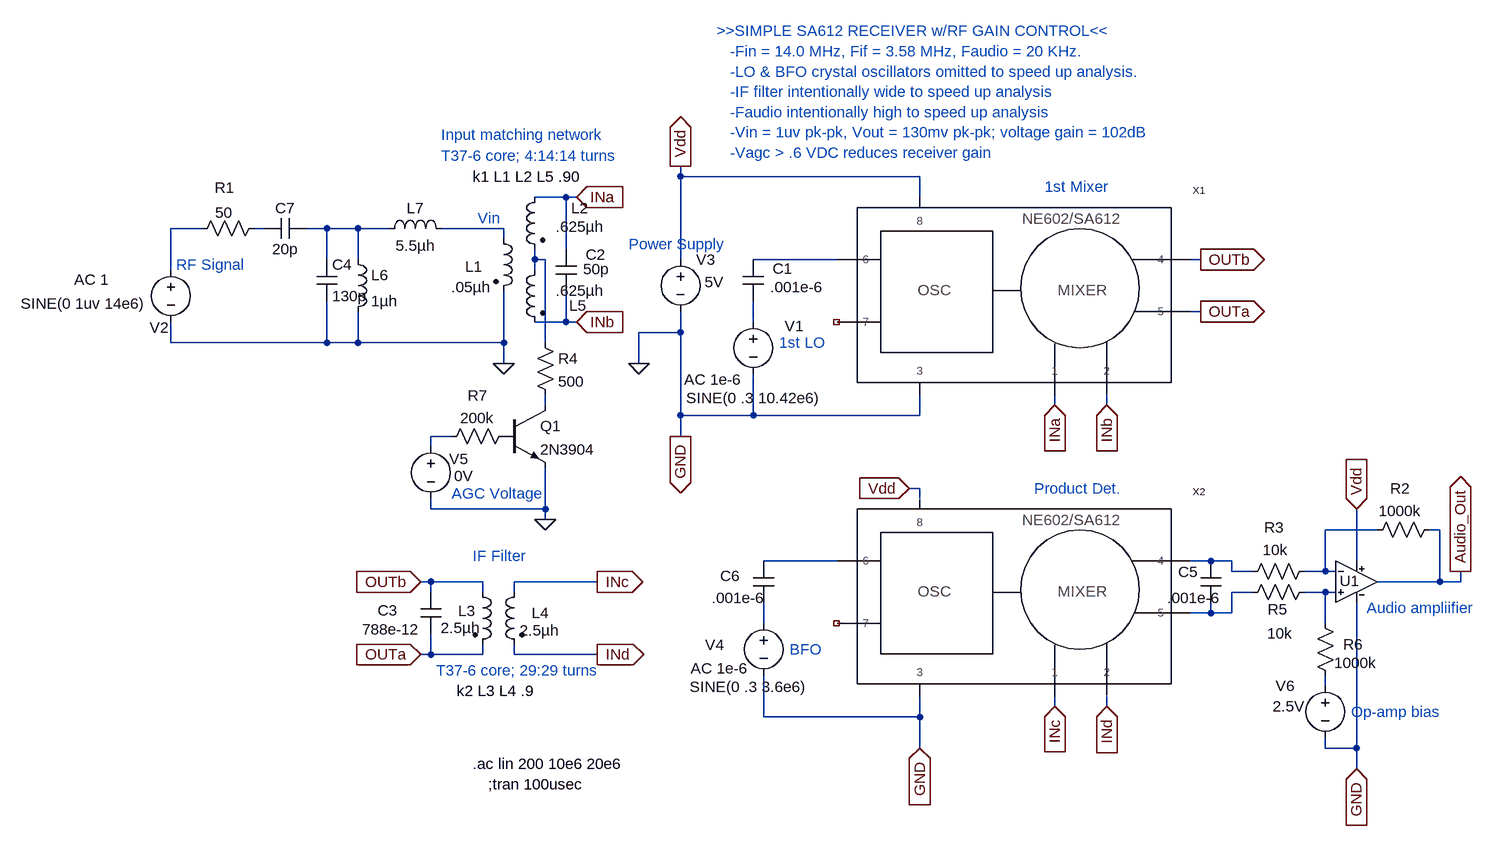
[diagram p0: schematic NE602 Rx.asc]
NE602 Rx.asc, the LTspice schematic file:
Version 4
SHEET 1 2600 1360
WIRE -176 -352 -176 -368
WIRE 192 -352 -176 -352
WIRE -352 -320 -400 -320
WIRE -336 -320 -352 -320
WIRE 192 -320 192 -352
WIRE -912 -272 -960 -272
WIRE -816 -272 -832 -272
WIRE -720 -272 -752 -272
WIRE -672 -272 -720 -272
WIRE -624 -272 -672 -272
WIRE -448 -272 -544 -272
WIRE -448 -256 -448 -272
WIRE -352 -240 -352 -320
WIRE -720 -224 -720 -272
WIRE -672 -224 -672 -272
WIRE -400 -224 -400 -240
WIRE -384 -224 -400 -224
WIRE -176 -224 -176 -352
WIRE 64 -224 -64 -224
WIRE 624 -224 608 -224
WIRE -960 -208 -960 -272
WIRE -400 -208 -400 -224
WIRE 624 -144 608 -144
WIRE -352 -128 -352 -176
WIRE -352 -128 -400 -128
WIRE -336 -128 -352 -128
WIRE -64 -128 -64 -160
WIRE -176 -112 -176 -144
WIRE -176 -112 -240 -112
WIRE -960 -96 -960 -128
WIRE -720 -96 -720 -160
WIRE -720 -96 -960 -96
WIRE -672 -96 -672 -144
WIRE -672 -96 -720 -96
WIRE -448 -96 -448 -176
WIRE -448 -96 -672 -96
WIRE -384 -96 -384 -224
WIRE -448 -64 -448 -96
WIRE -240 -64 -240 -112
WIRE -384 0 -384 -16
WIRE 400 0 400 -16
WIRE 480 0 480 -16
WIRE -176 16 -176 -112
WIRE -64 16 -64 -48
WIRE -64 16 -176 16
WIRE 192 16 192 -16
WIRE 192 16 -64 16
WIRE -528 48 -560 48
WIRE -176 48 -176 16
WIRE -560 64 -560 48
WIRE 192 128 176 128
WIRE 192 144 192 128
WIRE -560 160 -560 144
WIRE -384 160 -384 96
WIRE -384 160 -560 160
WIRE -384 176 -384 160
WIRE 896 192 816 192
WIRE 992 192 976 192
WIRE 64 240 -48 240
WIRE 640 240 608 240
WIRE 672 240 640 240
WIRE 864 240 864 160
WIRE 672 256 672 240
WIRE 704 256 672 256
WIRE 816 256 816 192
WIRE 816 256 784 256
WIRE 832 256 816 256
WIRE -560 272 -576 272
WIRE -480 272 -560 272
WIRE -304 272 -432 272
WIRE 992 272 992 192
WIRE 992 272 896 272
WIRE 1024 272 1024 256
WIRE 1024 272 992 272
WIRE -560 288 -560 272
WIRE -480 288 -480 272
WIRE -432 288 -432 272
WIRE 704 288 672 288
WIRE 816 288 784 288
WIRE 832 288 816 288
WIRE 640 320 640 304
WIRE 640 320 608 320
WIRE 672 320 672 288
WIRE 672 320 640 320
WIRE -48 336 -48 304
WIRE 816 336 816 288
WIRE -560 384 -560 352
WIRE -560 384 -576 384
WIRE -480 384 -480 368
WIRE -480 384 -560 384
WIRE -432 384 -432 368
WIRE -304 384 -432 384
WIRE 816 432 816 416
WIRE 400 464 400 448
WIRE 480 464 480 448
WIRE -48 480 -48 416
WIRE 192 480 192 448
WIRE 192 480 -48 480
WIRE 192 528 192 480
WIRE 816 528 816 512
WIRE 864 528 864 304
WIRE 864 528 816 528
WIRE 864 560 864 528
FLAG -176 -368 Vdd
IOPIN -176 -368 Out
FLAG -176 48 GND
IOPIN -176 48 Out
FLAG -240 -64 0
FLAG -576 272 OUTb
IOPIN -576 272 In
FLAG -576 384 OUTa
IOPIN -576 384 In
FLAG 624 -224 OUTb
IOPIN 624 -224 Out
FLAG 624 -144 OUTa
IOPIN 624 -144 Out
FLAG 400 0 INa
IOPIN 400 0 In
FLAG 480 0 INb
IOPIN 480 0 In
FLAG -304 272 INc
IOPIN -304 272 Out
FLAG 176 128 Vdd
IOPIN 176 128 In
FLAG 192 528 GND
IOPIN 192 528 In
FLAG 400 464 INc
IOPIN 400 464 In
FLAG 480 464 INd
IOPIN 480 464 In
FLAG -304 384 INd
IOPIN -304 384 Out
FLAG 864 160 Vdd
IOPIN 864 160 In
FLAG 864 560 GND
IOPIN 864 560 In
FLAG 1024 256 Audio_Out
IOPIN 1024 256 Out
FLAG -384 176 0
FLAG -448 -64 0
FLAG -336 -320 INa
IOPIN -336 -320 In
FLAG -336 -128 INb
IOPIN -336 -128 In
SYMBOL voltage -176 -240 R0
WINDOW 123 0 0 Left 0
WINDOW 39 0 0 Left 0
WINDOW 3 37 51 Left 0
SYMATTR Value 5V
SYMATTR InstName V3
SYMBOL ind2 -496 272 R0
WINDOW 0 -22 45 Left 0
WINDOW 3 -49 71 Left 0
SYMATTR InstName L3
SYMATTR Value 2.5µh
SYMATTR Type ind
SYMBOL ind2 -416 272 M0
WINDOW 0 -38 48 Left 0
WINDOW 3 -53 75 Left 0
SYMATTR InstName L4
SYMATTR Value 2.5µh
SYMATTR Type ind
SYMBOL cap -576 288 R0
WINDOW 3 -90 57 Left 0
WINDOW 0 -66 28 Left 0
SYMATTR Value 788e-12
SYMATTR InstName C3
SYMBOL sa612 304 -176 R0
SYMATTR InstName X1
SYMBOL voltage -64 -144 R0
WINDOW 123 -106 105 Left 0
WINDOW 39 0 0 Left 0
WINDOW 0 48 22 Left 0
WINDOW 3 -103 133 Left 0
SYMATTR Value2 AC 1e-6
SYMATTR InstName V1
SYMATTR Value SINE(0 .3 10.42e6)
SYMBOL cap -80 -224 R0
WINDOW 0 46 14 Left 0
WINDOW 3 42 42 Left 0
SYMATTR InstName C1
SYMATTR Value .001e-6
SYMBOL sa612 304 288 R0
SYMATTR InstName X2
SYMBOL voltage -48 320 R0
WINDOW 123 -112 85 Left 0
WINDOW 39 0 0 Left 0
WINDOW 0 -90 49 Left 0
WINDOW 3 -114 114 Left 0
SYMATTR Value2 AC 1e-6
SYMATTR InstName V4
SYMATTR Value SINE(0 .3 3.6e6)
SYMBOL cap -64 240 R0
WINDOW 0 -51 23 Left 0
WINDOW 3 -64 57 Left 0
SYMATTR InstName C6
SYMATTR Value .001e-6
SYMBOL UniversalOpamp 864 272 R0
WINDOW 0 -26 -1 Left 0
SYMATTR InstName U1
SYMBOL res 992 176 R90
WINDOW 0 -32 61 VBottom 0
WINDOW 3 -29 61 VTop 0
SYMATTR InstName R2
SYMATTR Value 1000k
SYMBOL res 800 240 R90
WINDOW 0 -36 63 VBottom 0
WINDOW 3 -33 61 VTop 0
SYMATTR InstName R3
SYMATTR Value 10k
SYMBOL res 800 272 R90
WINDOW 0 58 57 VBottom 0
WINDOW 3 64 54 VTop 0
SYMATTR InstName R5
SYMATTR Value 10k
SYMBOL res 832 432 R180
WINDOW 0 -42 64 Left 0
WINDOW 3 -64 35 Left 0
SYMATTR InstName R6
SYMATTR Value 1000k
SYMBOL voltage 816 416 R0
WINDOW 0 -76 16 Left 0
WINDOW 123 0 0 Left 0
WINDOW 39 0 0 Left 0
WINDOW 3 -81 48 Left 0
SYMATTR InstName V6
SYMATTR Value 2.5V
SYMBOL cap 624 240 R0
WINDOW 0 -34 17 Left 0
WINDOW 3 -51 57 Left 0
SYMATTR InstName C5
SYMATTR Value .001e-6
SYMBOL voltage -960 -224 R0
WINDOW 123 -149 31 Left 0
WINDOW 39 0 0 Left 0
WINDOW 0 -33 105 Left 0
WINDOW 3 -231 68 Left 0
SYMATTR Value2 AC 1
SYMATTR InstName V2
SYMATTR Value SINE(0 1uv 14e6)
SYMBOL ind2 -464 -272 R0
WINDOW 0 -43 59 Left 0
WINDOW 3 -65 90 Left 0
SYMATTR InstName L1
SYMATTR Value .05µh
SYMATTR Type ind
SYMBOL ind2 -384 -336 M0
WINDOW 0 -67 33 Left 0
WINDOW 3 -90 61 Left 0
SYMATTR InstName L2
SYMATTR Value .625µh
SYMATTR Type ind
SYMBOL res -816 -288 R90
WINDOW 0 -31 61 VBottom 0
WINDOW 3 -24 62 VTop 0
SYMATTR InstName R1
SYMATTR Value 50
SYMBOL cap -368 -240 R0
WINDOW 3 42 31 Left 0
WINDOW 0 46 8 Left 0
SYMATTR Value 50p
SYMATTR InstName C2
SYMBOL ind2 -384 -224 M0
WINDOW 0 -64 71 Left 0
WINDOW 3 -90 48 Left 0
SYMATTR InstName L5
SYMATTR Value .625µh
SYMATTR Type ind
SYMBOL res -400 -112 R0
SYMATTR InstName R4
SYMATTR Value 500
SYMBOL voltage -560 48 R0
WINDOW 123 0 0 Left 0
WINDOW 39 0 0 Left 0
WINDOW 0 28 35 Left 0
WINDOW 3 36 61 Left 0
SYMATTR InstName V5
SYMATTR Value 0V
SYMBOL npn -448 0 R0
SYMATTR InstName Q1
SYMATTR Value 2N3904
SYMBOL res -432 32 R90
WINDOW 0 -31 56 VBottom 0
WINDOW 3 -28 57 VTop 0
SYMATTR InstName R7
SYMATTR Value 200k
SYMBOL ind -688 -240 R0
SYMATTR InstName L6
SYMATTR Value 1µh
SYMATTR SpiceLine Rser=.01
SYMBOL cap -736 -224 R0
SYMATTR InstName C4
SYMATTR Value 130p
SYMBOL cap -752 -288 R90
WINDOW 0 0 32 VBottom 0
WINDOW 3 32 32 VTop 0
SYMATTR InstName C7
SYMATTR Value 20p
SYMBOL ind -640 -256 R270
WINDOW 0 32 56 VTop 0
WINDOW 3 5 56 VBottom 0
SYMATTR InstName L7
SYMATTR Value 5.5µh
SYMATTR SpiceLine Rser=0
TEXT -472 584 Left 0 !;tran 100usec
TEXT -256 -248 Left 0 ;Power Supply
TEXT -520 440 Left 0 !k2 L3 L4 .9
TEXT 384 -336 Left 0 ;1st Mixer
TEXT 368 128 Left 0 ;Product Det.
TEXT -496 232 Left 0 ;IF Filter
TEXT -120 -576 Left 0 ;>>SIMPLE SA612 RECEIVER w/RF GAIN CONTROL<<\n   -Fin = 14.0 MHz, Fif = 3.58 MHz, Faudio = 20 KHz.\n   -LO & BFO crystal oscillators omitted to speed up analysis.\n   -IF filter intentionally wide to speed up analysis\n   -Faudio intentionally high to speed up analysis\n   -Vin = 1uv pk-pk, Vout = 130mv pk-pk; voltage gain = 102dB\n   -Vagc > .6 VDC reduces receiver gain
TEXT -8 376 Left 0 ;BFO
TEXT 880 312 Left 0 ;Audio ampliifier
TEXT 856 472 Left 0 ;Op-amp bias
TEXT -24 -96 Left 0 ;1st LO
TEXT -496 552 Left 0 !.ac lin 200 10e6 20e6
TEXT -552 408 Left 0 ;T37-6 core; 29:29 turns
TEXT -496 -352 Left 0 !k1 L1 L2 L5 .90
TEXT -544 -416 Left 0 ;Input matching network
TEXT -528 136 Left 0 ;AGC Voltage
TEXT -952 -216 Left 0 ;RF Signal
TEXT -488 -288 Left 0 ;Vin
TEXT -544 -384 Left 0 ;T37-6 core; 4:14:14 turns

The netlist it stands for:
* NE602 Rx.asc
V3 Vdd 0 5V
L3 OUTb OUTa 2.5µh
L4 INc INd 2.5µh
C3 OUTb OUTa 788e-12
XX1 INa INb 0 OUTb OUTa N006 NC_01 Vdd sa612  ; pins 1 2 3 4 5 6 7 8
V1 N007 0 SINE(0 .3 10.42e6) AC 1e-6
C1 N006 N007 .001e-6
XX2 INc INd 0 N012 N013 N011 NC_02 Vdd sa612  ; pins 1 2 3 4 5 6 7 8
V4 N015 0 SINE(0 .3 3.6e6) AC 1e-6
C6 N011 N015 .001e-6
XU1 N014 N010 Vdd 0 Audio_Out level2 Avol=1Meg GBW=10Meg Slew=10Meg ilimit=25m rail=0 Vos=0 phimargin=45 en=0 enk=0 in=0 ink=0 Rin=500Meg  ; pins In+ In- V+ V- OUT
R2 Audio_Out N010 1000k
R3 N010 N012 10k
R5 N014 N013 10k
R6 N016 N014 1000k
V6 N016 0 2.5V
C5 N012 N013 .001e-6
V2 N001 0 SINE(0 1uv 14e6) AC 1
L1 N004 0 .05µh
L2 INa N005 .625µh
R1 N002 N001 50
C2 INa INb 50p
L5 N005 INb .625µh
R4 N005 N008 500
V5 N009 0 0V
Q1 N008 P001 0 0 2N3904
R7 P001 N009 200k
L6 N003 0 1µh Rser=.01
C4 N003 0 130p
C7 N003 N002 20p
L7 N003 N004 5.5µh Rser=0
.model NPN NPN
.model PNP PNP
.lib standard.bjt
;tran 100usec
* Power Supply
k2 L3 L4 .9
* 1st Mixer
* Product Det.
* IF Filter
* >>SIMPLE SA612 RECEIVER w/RF GAIN CONTROL<<
*    -Fin = 14.0 MHz, Fif = 3.58 MHz, Faudio = 20 KHz.
*    -LO & BFO crystal oscillators omitted to speed up analysis.
*    -IF filter intentionally wide to speed up analysis
*    -Faudio intentionally high to speed up analysis
*    -Vin = 1uv pk-pk, Vout = 130mv pk-pk; voltage gain = 102dB
*    -Vagc > .6 VDC reduces receiver gain
* BFO
* Audio ampliifier
* Op-amp bias
* 1st LO
.ac lin 200 10e6 20e6
* T37-6 core; 29:29 turns
k1 L1 L2 L5 .90
* Input matching network
* AGC Voltage
* RF Signal
* Vin
* T37-6 core; 4:14:14 turns
.lib UniversalOpamps.sub
.backanno
.end